# Altium schematic sheet Conectors.SchDoc
size A4; SheetNumber: 3; SheetTotal: 3
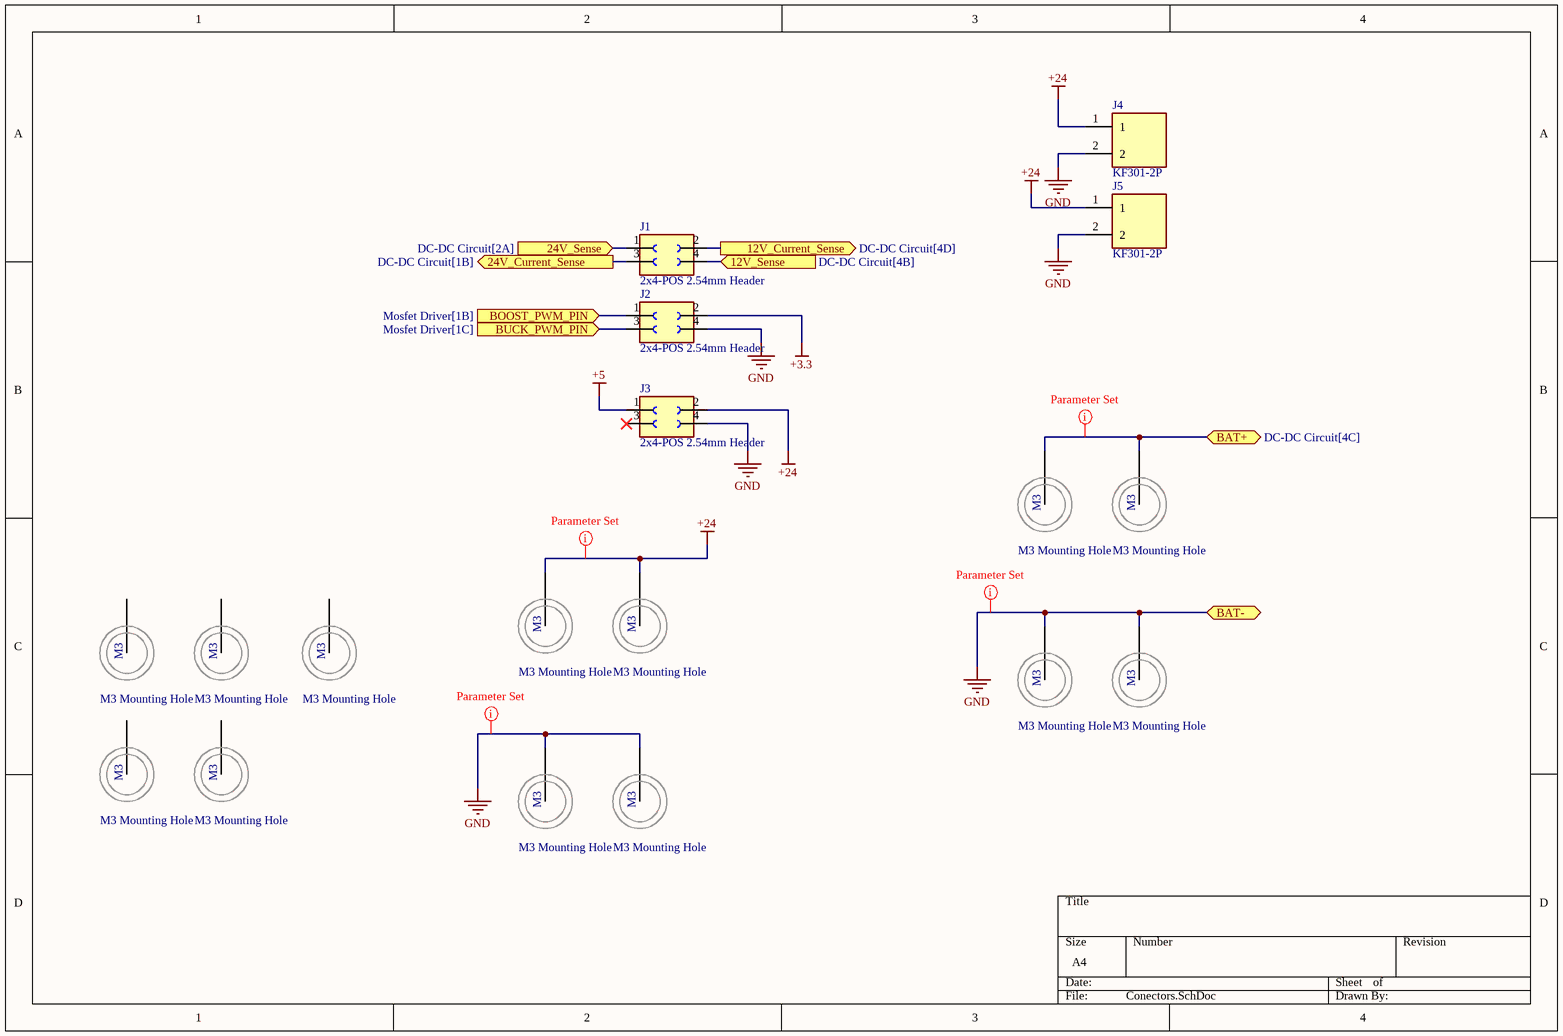
[diagram p0: Conectors.SchDoc]

## Parts
(Parts that share a designator on the sheet are numbered #1, #2 ... from top to bottom, then left to right.)
?#1  M3 Mounting Hole  [M3 - Mounting Hole]
?#2  M3 Mounting Hole  [M3 - Mounting Hole]
?#3  M3 Mounting Hole  [M3 - Mounting Hole]
?#4  M3 Mounting Hole  [M3 - Mounting Hole]
?#5  M3 Mounting Hole  [M3 - Mounting Hole]
?#6  M3 Mounting Hole  [M3 - Mounting Hole]
?#7  M3 Mounting Hole  [M3 - Mounting Hole]
?#8  M3 Mounting Hole  [M3 - Mounting Hole]
?#9  M3 Mounting Hole  [M3 - Mounting Hole]
?#10  M3 Mounting Hole  [M3 - Mounting Hole]
?#11  M3 Mounting Hole  [M3 - Mounting Hole]
?#12  M3 Mounting Hole  [M3 - Mounting Hole]
?#13  M3 Mounting Hole  [M3 - Mounting Hole]
J1  2x4-POS 2.54mm Header  [2x4-POS 2.54mm Female Header]
J2  2x4-POS 2.54mm Header  [2x4-POS 2.54mm Female Header]
J3  2x4-POS 2.54mm Header  [2x4-POS 2.54mm Female Header]
J4  KF301-2P  [KF301-2P]
J5  KF301-2P  [KF301-2P]

## Ports
12V_Current_Sense (out, see DC-DC Circuit[4D]), 12V_Sense (in, see DC-DC Circuit[4B]), 24V_Current_Sense (out, see DC-DC Circuit[1B]), 24V_Sense (in, see DC-DC Circuit[2A]), BAT+ (bidir, see DC-DC Circuit[4C]), BAT- (bidir), BOOST_PWM_PIN (in, see Mosfet Driver[1B]), BUCK_PWM_PIN (in, see Mosfet Driver[1C])

## Nets
+3.3: J2.2
+5: J3.1
+24: ?#3.1(M3) ?#4.1(M3) J3.2 J4.1 J5.1
GND: ?#8.1(M3) ?#9.1(M3) ?#12.1(M3) ?#13.1(M3) J2.4 J3.4 J4.2 J5.2 ; port BAT-
12V_Current_Sense: J1.2 ; port 12V_Current_Sense
12V_Sense: J1.4 ; port 12V_Sense
24V_Current_Sense: J1.3 ; port 24V_Current_Sense
24V_Sense: J1.1 ; port 24V_Sense
BAT+: ?#1.1(M3) ?#2.1(M3) ; port BAT+
BOOST_PWM_PIN: J2.1 ; port BOOST_PWM_PIN
BUCK_PWM_PIN: J2.3 ; port BUCK_PWM_PIN

Not connected (* = marked no-connect by the designer): ?#5 1(M3); ?#6 1(M3); ?#7 1(M3); ?#10 1(M3); ?#11 1(M3); J3 3(2)*

## Layout directives
net class DirectPour: +24, BAT+, GND

## Library data of the parts
J1-J3 = 2x4-POS 2.54mm Header: Female header [WÃ¼rth Elektronik] 613004243121 Female header; SnapEDA_Link: https://www.snapeda.com/parts/613004243121/W%C3%BCrth%20Elektronik/view-part/1737074/?ref=snap; Check_prices: https://www.snapeda.com/parts/613004243121/W%C3%BCrth%20Elektronik/view-part/1737074/?ref=eda; Availability: Unavailable; Value: *; MF: WÃ¼rth Elektronik; Price: None; MP: 613004243121; Package: None
J4 J5 = KF301-2P: 2 Pin Terminal Block 5mm Pitch; Price: None; Value: *; MP: KF301-2P; Package: None; Availability: Unavailable